# EasyEDA Pro project ProDoc_Schematic1_2024-09-24.epro

# Schematic Schematic1
Board Name: Board1; Create Date: 2024-09-06
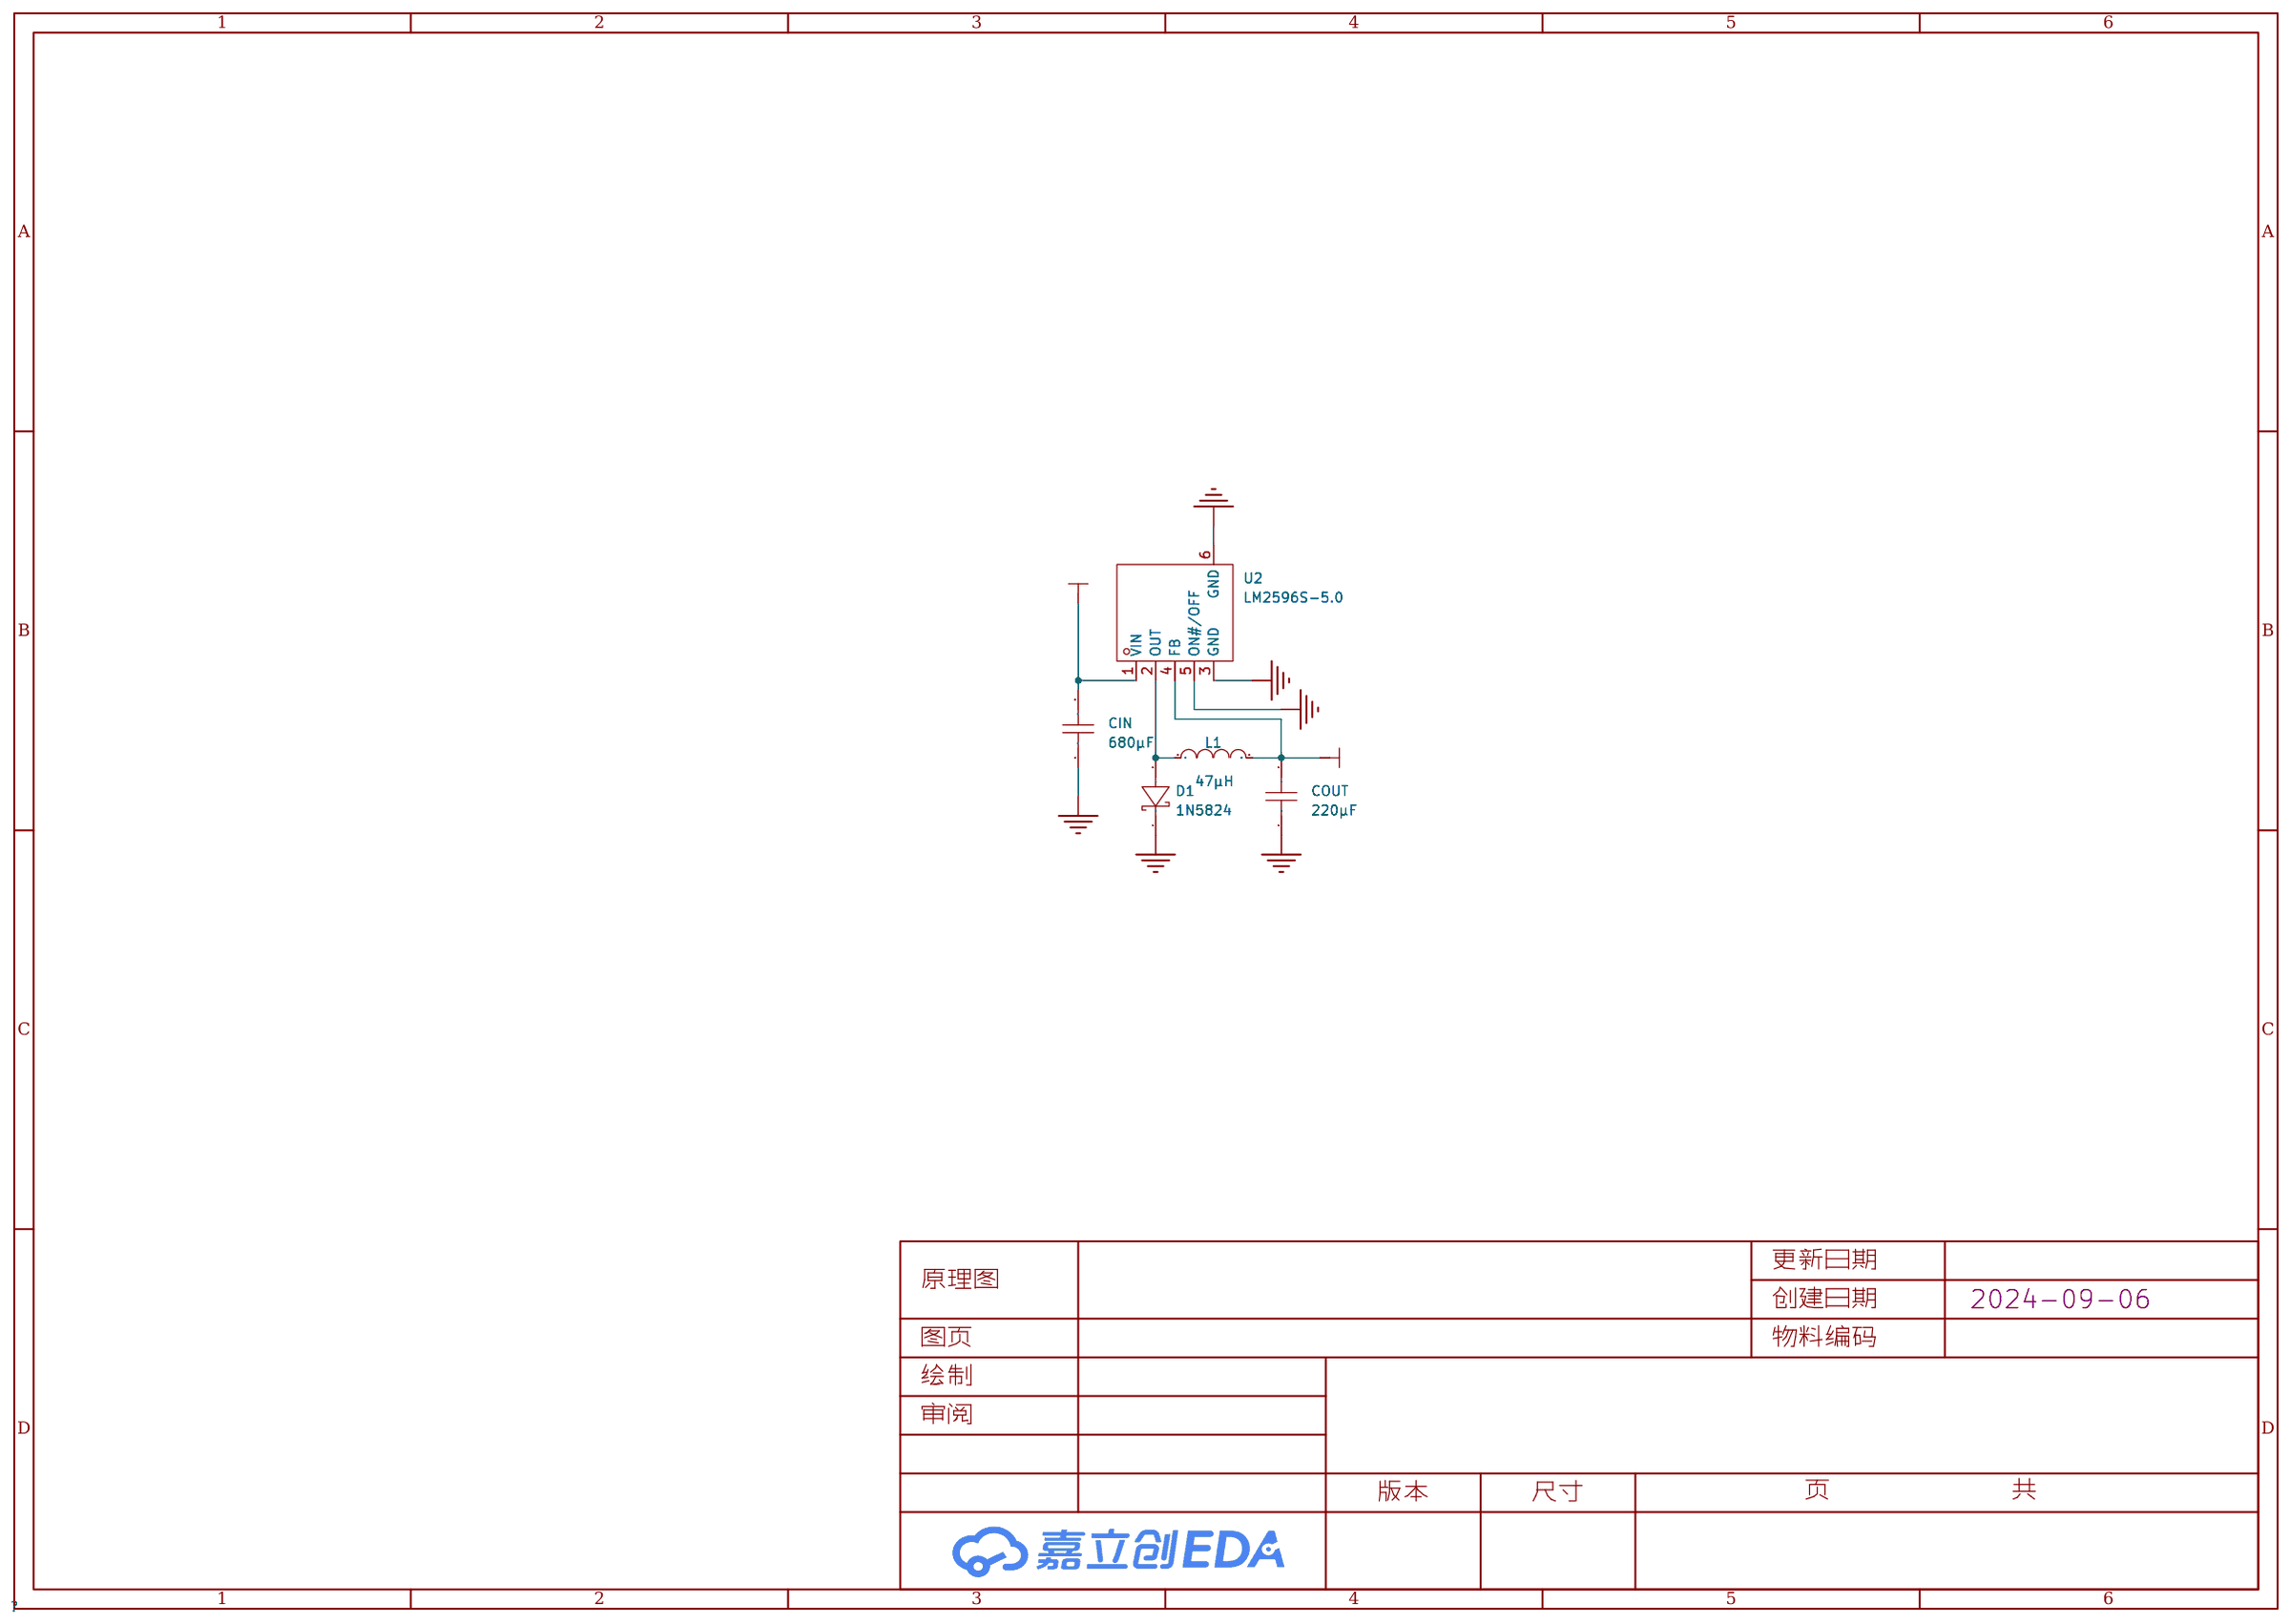
[diagram p0: schematic sheet]

## Parts
CIN  680μF  [C0603]
COUT  220μF  [C0603]
D1  1N5824  [DO-27_BD5.3-L8.4-P12.40-D1.3-RD]
L1  47μH  [L0603]
U2  LM2596S-5.0  [TO-263-5_L10.1-W8.7-P1.70-LS15.2-BR]

## Library data of the parts
CIN COUT = CAP_0603: Supplier Footprint: 0603
D1 = 1N5824_C7503125: 二极管配置:独立式;正向压降(Vf):550mV@5A;直流反向耐压(Vr):30V;平均整流电流(Io):5A;; LCSC Part Name: 电压:30V 电流:5A; Supplier Part: C7503125; Manufacturer: FUXINSEMI(富芯森美); Supplier Footprint: DO-201AD; JLCPCB Part Class: 扩展库; Datasheet: https://atta.szlcsc.com/upload/public/pdf/source/20230904/20F3394C6D1B7A17743713246CA97DB3.pdf; Supplier: LCSC; Diode Configuration: 独立式; Forward Voltage (Vf@If): 550mV@5A; Reverse Voltage (Vr): 30V; Average Rectified Current (Io): 5A; Reverse Leakage Current (Ir): 500uA@30V; Peak forward surge current: 150A
L1 = L_0603
U2 = LM2596S-5.0_C5276750: 功能类型：降压型 输出类型：固定 输入电压：40V 输出电压：5V 输出电流(最大值)：3A; Supplier Part: C5276750; Manufacturer: TWGMC(台湾迪嘉); Supplier Footprint: TO-263-5; JLCPCB Part Class: 扩展库; Datasheet: https://atta.szlcsc.com/upload/public/pdf/source/20221121/BE66229392871E6008E3503EDFD620B9.pdf; Supplier: LCSC

## Nets
5V: COUT.2 L1.2 U2.4(FB)
24V: CIN.2 U2.1(VIN)
GND: CIN.1 COUT.1 D1.1(K) U2.3(GND) U2.5(ON#/OFF) U2.6(GND)
Net-(D1-2): D1.2(A) L1.1 U2.2(OUT)
